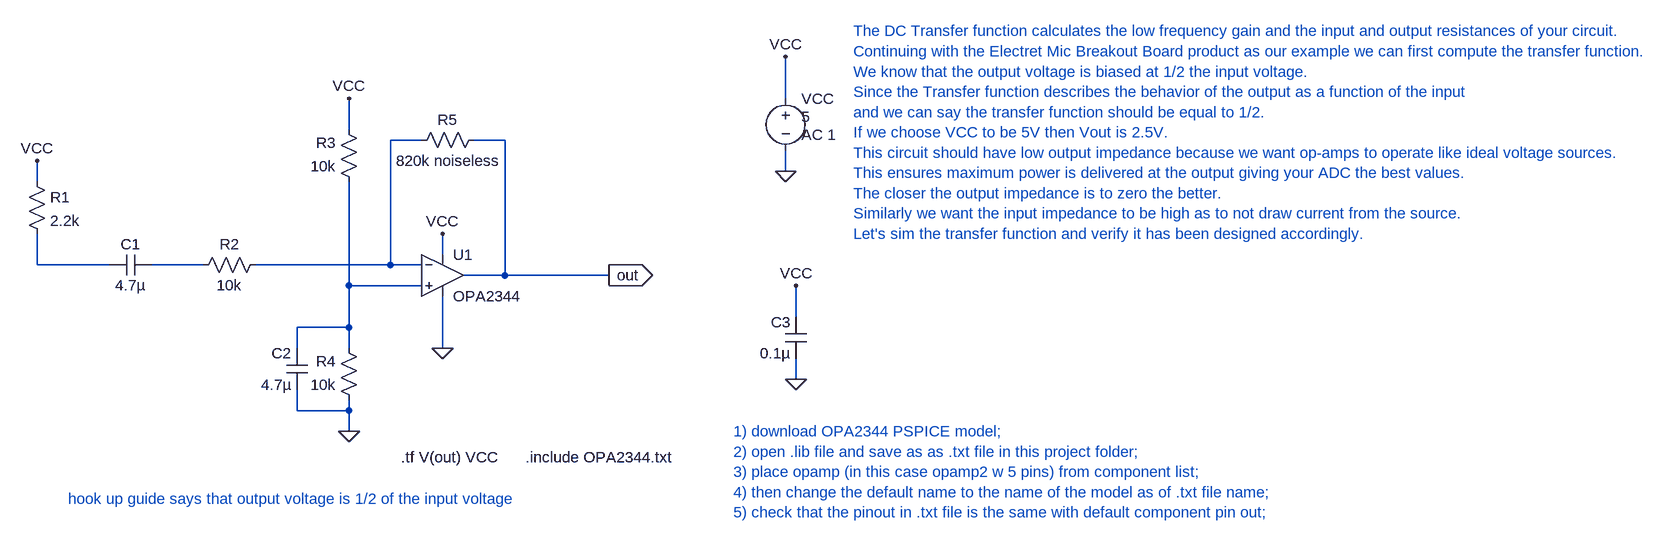
[diagram p0: schematic DC_transfer.asc]
DC_transfer.asc, the LTspice schematic file:
Version 4
SHEET 1 3664 680
WIRE 1024 -112 1024 -176
WIRE 352 -64 352 -112
WIRE 464 -48 416 -48
WIRE 592 -48 544 -48
WIRE 1024 0 1024 -32
WIRE -128 16 -128 -16
WIRE 496 128 496 96
WIRE -128 144 -128 96
WIRE -16 144 -128 144
WIRE 128 144 48 144
WIRE 416 144 416 -48
WIRE 416 144 208 144
WIRE 464 144 416 144
WIRE 592 160 592 -48
WIRE 592 160 528 160
WIRE 752 160 592 160
WIRE 352 176 352 16
WIRE 464 176 352 176
WIRE 1040 224 1040 176
WIRE 352 240 352 176
WIRE 352 240 272 240
WIRE 272 272 272 240
WIRE 352 272 352 240
WIRE 496 272 496 192
WIRE 1040 320 1040 288
WIRE 272 368 272 336
WIRE 352 368 352 352
WIRE 352 368 272 368
WIRE 352 400 352 368
FLAG 352 400 0
FLAG 496 272 0
FLAG 1040 320 0
FLAG 1024 0 0
FLAG 1024 -176 VCC
FLAG -128 -16 VCC
FLAG 352 -112 VCC
FLAG 752 160 out
IOPIN 752 160 Out
FLAG 1040 176 VCC
FLAG 496 96 VCC
SYMBOL res -144 0 R0
SYMATTR InstName R1
SYMATTR Value 2.2k
SYMBOL res 224 128 R90
WINDOW 0 0 56 VBottom 2
WINDOW 3 32 56 VTop 2
SYMATTR InstName R2
SYMATTR Value 10k
SYMBOL res 368 32 R180
WINDOW 0 36 76 Left 2
WINDOW 3 36 40 Left 2
SYMATTR InstName R3
SYMATTR Value 10k
SYMBOL res 368 368 R180
WINDOW 0 36 76 Left 2
WINDOW 3 36 40 Left 2
SYMATTR InstName R4
SYMATTR Value 10k
SYMBOL res 448 -32 R270
WINDOW 0 32 56 VTop 2
WINDOW 3 0 56 VBottom 2
SYMATTR InstName R5
SYMATTR Value 820k noiseless
SYMBOL cap 48 128 R90
WINDOW 0 0 32 VBottom 2
WINDOW 3 32 32 VTop 2
SYMATTR InstName C1
SYMATTR Value 4.7µ
SYMBOL cap 288 336 R180
WINDOW 0 24 56 Left 2
WINDOW 3 24 8 Left 2
SYMATTR InstName C2
SYMATTR Value 4.7µ
SYMBOL cap 1056 288 R180
WINDOW 0 24 56 Left 2
WINDOW 3 24 8 Left 2
SYMATTR InstName C3
SYMATTR Value 0.1µ
SYMBOL voltage 1024 -128 R0
WINDOW 3 24 44 Left 2
WINDOW 123 24 72 Left 2
WINDOW 39 0 0 Left 0
SYMATTR Value 5
SYMATTR Value2 AC 1
SYMATTR InstName VCC
SYMBOL OpAmps\\opamp2 496 96 R0
SYMATTR InstName U1
SYMATTR Value OPA2344
TEXT -80 504 Left 2 ;hook up guide says that output voltage is 1/2 of the input voltage
TEXT 944 400 Left 2 ;1) download OPA2344 PSPICE model;\n2) open .lib file and save as as .txt file in this project folder;\n3) place opamp (in this case opamp2 w 5 pins) from component list;\n4) then change the default name to the name of the model as of .txt file name;\n5) check that the pinout in .txt file is the same with default component pin out;
TEXT 624 440 Left 2 !.include OPA2344.txt
TEXT 1128 -216 Left 2 ;The DC Transfer function calculates the low frequency gain and the input and output resistances of your circuit.\nContinuing with the Electret Mic Breakout Board product as our example we can first compute the transfer function.\nWe know that the output voltage is biased at 1/2 the input voltage.\nSince the Transfer function describes the behavior of the output as a function of the input\nand we can say the transfer function should be equal to 1/2.\nIf we choose VCC to be 5V then Vout is 2.5V.\nThis circuit should have low output impedance because we want op-amps to operate like ideal voltage sources.\nThis ensures maximum power is delivered at the output giving your ADC the best values.\nThe closer the output impedance is to zero the better.\nSimilarly we want the input impedance to be high as to not draw current from the source.\nLet's sim the transfer function and verify it has been designed accordingly.
TEXT 432 440 Left 2 !.tf V(out) VCC

The netlist it stands for:
* DC_transfer.asc
R1 VCC N002 2.2k
R2 N001 N003 10k
R3 N004 VCC 10k
R4 0 N004 10k
R5 N001 out 820k noiseless
C1 N003 N002 4.7µ
C2 0 N004 4.7µ
C3 0 VCC 0.1µ
VCC VCC 0 5 AC 1
XU1 N004 N001 VCC 0 out OPA2344  ; pins In+ In- V+ V- OUT
* hook up guide says that output voltage is 1/2 of the input voltage
* 1) download OPA2344 PSPICE model;
* 2) open .lib file and save as as .txt file in this project folder;
* 3) place opamp (in this case opamp2 w 5 pins) from component list;
* 4) then change the default name to the name of the model as of .txt file name;
* 5) check that the pinout in .txt file is the same with default component pin out;
.include OPA2344.txt
* The DC Transfer function calculates the low frequency gain and the input and output resistances of your circuit.
* Continuing with the Electret Mic Breakout Board product as our example we can first compute the transfer function.
* We know that the output voltage is biased at 1/2 the input voltage.
* Since the Transfer function describes the behavior of the output as a function of the input
* and we can say the transfer function should be equal to 1/2.
* If we choose VCC to be 5V then Vout is 2.5V.
* This circuit should have low output impedance because we want op-amps to operate like ideal voltage sources.
* This ensures maximum power is delivered at the output giving your ADC the best values.
* The closer the output impedance is to zero the better.
* Similarly we want the input impedance to be high as to not draw current from the source.
* Let's sim the transfer function and verify it has been designed accordingly.
.tf V(out) VCC
.backanno
.end